# EAGLE design MotorShield (EAGLE 6.6.0)
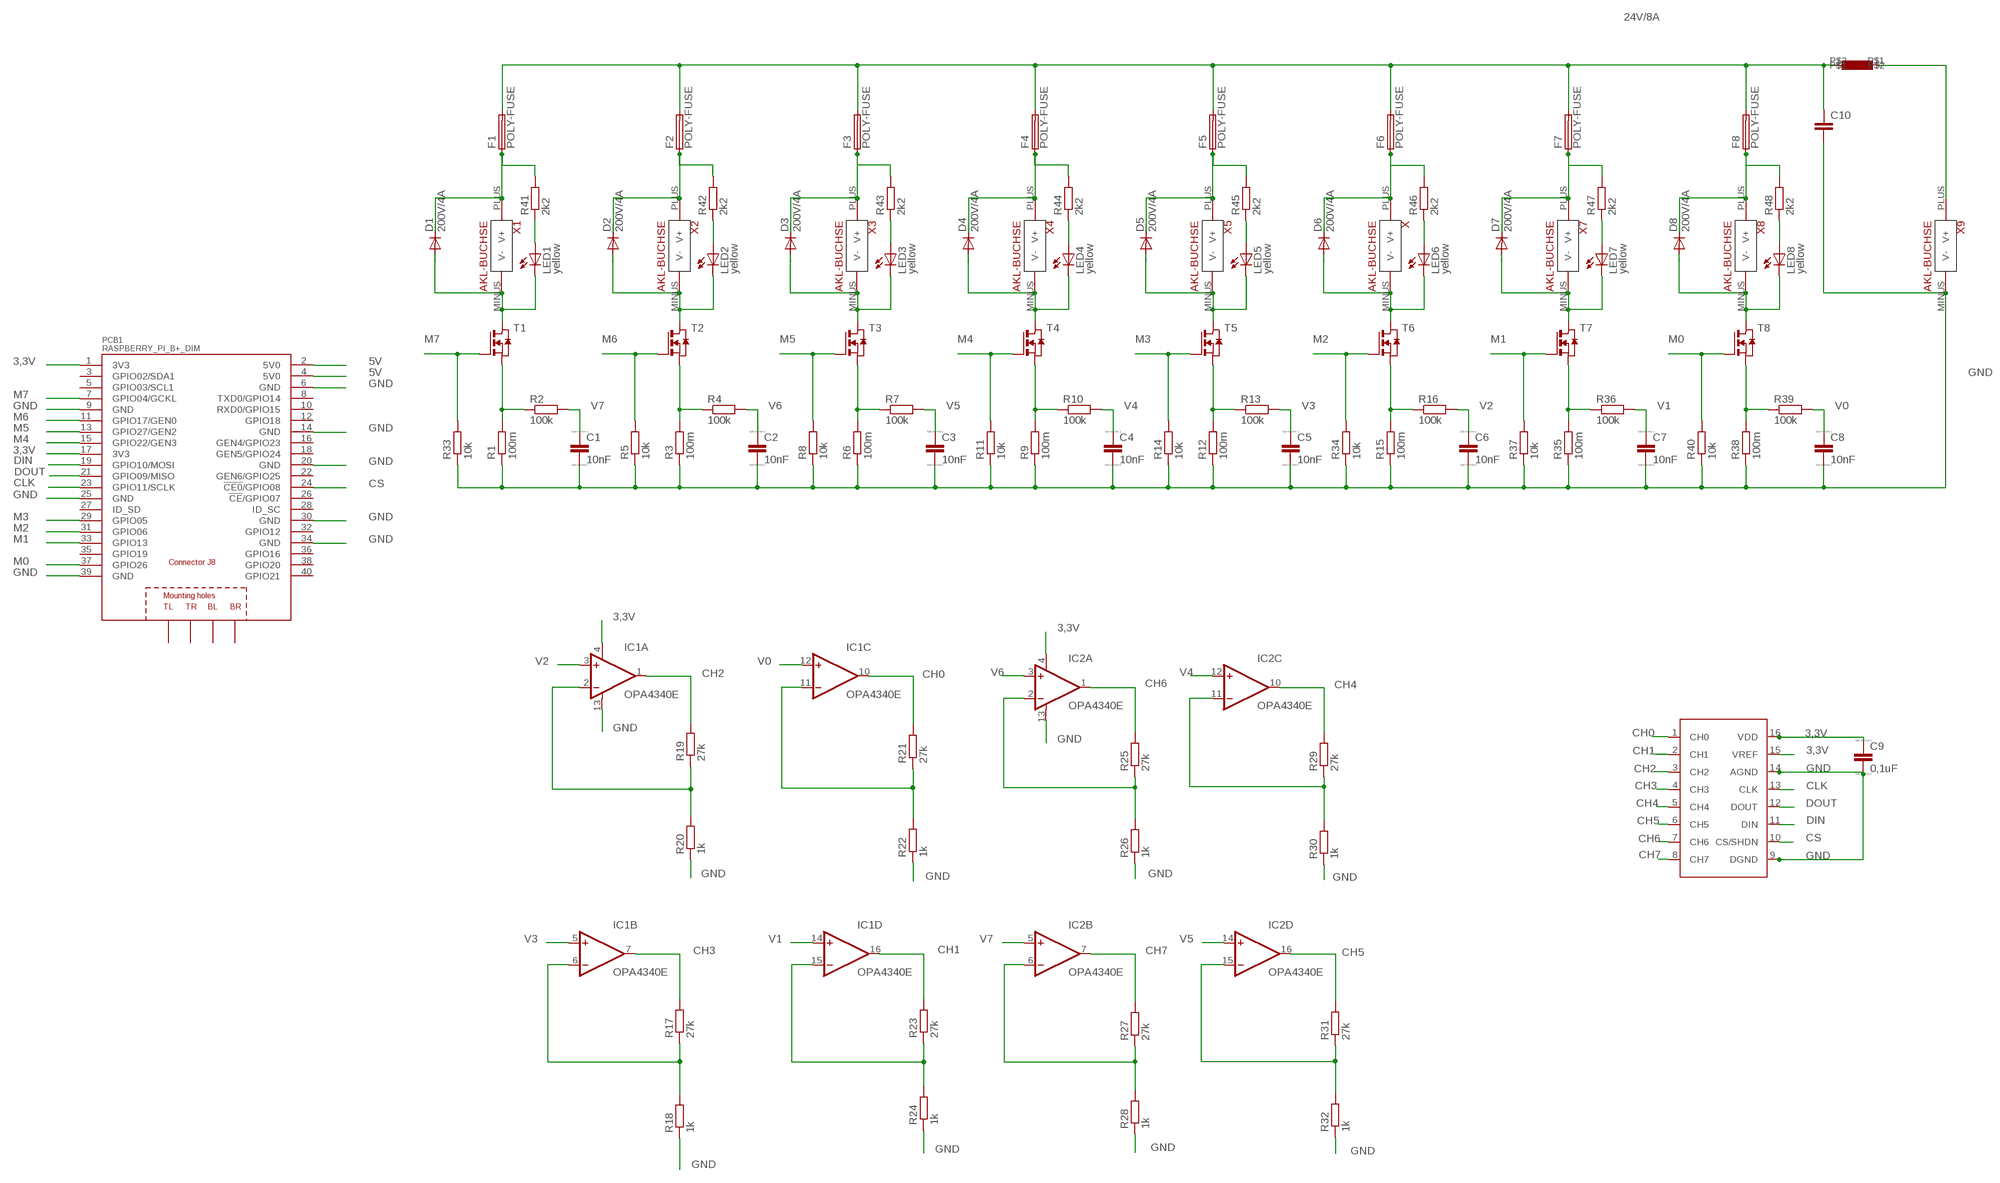
[diagram p0: schematic, sheet 1]

## Parts
C1  10nF  C  [C0805]
C2  10nF  C  [C0805]
C3  10nF  C  [C0805]
C4  10nF  C  [C0805]
C5  10nF  C  [C0805]
C6  10nF  C  [C0805]
C7  10nF  C  [C0805]
C8  10nF  C  [C0805]
C9  0,1uF  C  [C0805]
C10  C-EUC1812  [C1812]
D1  200V/4A  DIODE-DO214AA  [DO214AA]
D2  200V/4A  DIODE-DO214AA  [DO214AA]
D3  200V/4A  DIODE-DO214AA  [DO214AA]
D4  200V/4A  DIODE-DO214AA  [DO214AA]
D5  200V/4A  DIODE-DO214AA  [DO214AA]
D6  200V/4A  DIODE-DO214AA  [DO214AA]
D7  200V/4A  DIODE-DO214AA  [DO214AA]
D8  200V/4A  DIODE-DO214AA  [DO214AA]
F1  POLY-FUSE  [1812L050]
F2  POLY-FUSE  [1812L050]
F3  POLY-FUSE  [1812L050]
F4  POLY-FUSE  [1812L050]
F5  POLY-FUSE  [1812L050]
F6  POLY-FUSE  [1812L050]
F7  POLY-FUSE  [1812L050]
F8  POLY-FUSE  [1812L050]
IC1  OPA4340E  [SSOP16BU]
IC2  OPA4340E  [SSOP16BU]
IC3  MCP3008SO16  [SO16]
L1  MPI4040  [4040]
LED1  yellow  LEDCHIP-LED0603  [CHIP-LED0603]
LED2  yellow  LEDCHIP-LED0603  [CHIP-LED0603]
LED3  yellow  LEDCHIP-LED0603  [CHIP-LED0603]
LED4  yellow  LEDCHIP-LED0603  [CHIP-LED0603]
LED5  yellow  LEDCHIP-LED0603  [CHIP-LED0603]
LED6  yellow  LEDCHIP-LED0603  [CHIP-LED0603]
LED7  yellow  LEDCHIP-LED0603  [CHIP-LED0603]
LED8  yellow  LEDCHIP-LED0603  [CHIP-LED0603]
PCB1  RASPBERRY_PI_B+_DIM  [RASPBERRY_PI_BPLUS_DIM]
R1  100m  R-EU_R0805  [R0805]
R2  100k  R-EU_R0805  [R0805]
R3  100m  R-EU_R0805  [R0805]
R4  100k  R-EU_R0805  [R0805]
R5  10k  R-EU_R0805  [R0805]
R6  100m  R-EU_R0805  [R0805]
R7  100k  R-EU_R0805  [R0805]
R8  10k  R-EU_R0805  [R0805]
R9  100m  R-EU_R0805  [R0805]
R10  100k  R-EU_R0805  [R0805]
R11  10k  R-EU_R0805  [R0805]
R12  100m  R-EU_R0805  [R0805]
R13  100k  R-EU_R0805  [R0805]
R14  10k  R-EU_R0805  [R0805]
R15  100m  R-EU_R0805  [R0805]
R16  100k  R-EU_R0805  [R0805]
R17  27k  R-EU_R0805  [R0805]
R18  1k  R-EU_R0805  [R0805]
R19  27k  R-EU_R0805  [R0805]
R20  1k  R-EU_R0805  [R0805]
R21  27k  R-EU_R0805  [R0805]
R22  1k  R-EU_R0805  [R0805]
R23  27k  R-EU_R0805  [R0805]
R24  1k  R-EU_R0805  [R0805]
R25  27k  R-EU_R0805  [R0805]
R26  1k  R-EU_R0805  [R0805]
R27  27k  R-EU_R0805  [R0805]
R28  1k  R-EU_R0805  [R0805]
R29  27k  R-EU_R0805  [R0805]
R30  1k  R-EU_R0805  [R0805]
R31  27k  R-EU_R0805  [R0805]
R32  1k  R-EU_R0805  [R0805]
R33  10k  R-EU_R0805  [R0805]
R34  10k  R-EU_R0805  [R0805]
R35  100m  R-EU_R0805  [R0805]
R36  100k  R-EU_R0805  [R0805]
R37  10k  R-EU_R0805  [R0805]
R38  100m  R-EU_R0805  [R0805]
R39  100k  R-EU_R0805  [R0805]
R40  10k  R-EU_R0805  [R0805]
R41  2k2  R-EU_R0603  [R0603]
R42  2k2  R-EU_R0603  [R0603]
R43  2k2  R-EU_R0603  [R0603]
R44  2k2  R-EU_R0603  [R0603]
R45  2k2  R-EU_R0603  [R0603]
R46  2k2  R-EU_R0603  [R0603]
R47  2k2  R-EU_R0603  [R0603]
R48  2k2  R-EU_R0603  [R0603]
T1  NMOSSOT23  [SOT-23]
T2  NMOSSOT23  [SOT-23]
T3  NMOSSOT23  [SOT-23]
T4  NMOSSOT23  [SOT-23]
T5  NMOSSOT23  [SOT-23]
T6  NMOSSOT23  [SOT-23]
T7  NMOSSOT23  [SOT-23]
T8  NMOSSOT23  [SOT-23]
X  AKL-BUCHSE  [AKL-BUCHSE]
X1  AKL-BUCHSE  [AKL-BUCHSE]
X2  AKL-BUCHSE  [AKL-BUCHSE]
X3  AKL-BUCHSE  [AKL-BUCHSE]
X4  AKL-BUCHSE  [AKL-BUCHSE]
X5  AKL-BUCHSE  [AKL-BUCHSE]
X7  AKL-BUCHSE  [AKL-BUCHSE]
X8  AKL-BUCHSE  [AKL-BUCHSE]
X9  AKL-BUCHSE  [AKL-BUCHSE]

## Nets
3,3V: C9.1 IC1.4(A:V+) IC2.4(A:V+) IC3.15(VREF) IC3.16(VDD) PCB1.1(3V3) PCB1.17(3V3)
5V: PCB1.2(5V0) PCB1.4(5V0)
24V/1A [2.2A]: D1.C F1.P$1 R41.2 X1.PLUS(V+)
24V/8A: C10.1 F1.P$2 F2.P$2 F3.P$2 F4.P$2 F5.P$2 F6.P$2 F7.P$2 F8.P$2 L1.P$2
CH0: IC1.10(C:OUT) IC3.1(CH0) R21.2
CH1: IC1.16(D:OUT) IC3.2(CH1) R23.2
CH2: IC1.1(A:OUT) IC3.3(CH2) R19.2
CH3: IC1.7(B:OUT) IC3.4(CH3) R17.2
CH4: IC2.10(C:OUT) IC3.5(CH4) R29.2
CH5: IC2.16(D:OUT) IC3.6(CH5) R31.2
CH6: IC2.1(A:OUT) IC3.7(CH6) R25.2
CH7: IC2.7(B:OUT) IC3.8(CH7) R27.2
CLK: IC3.13(CLK) PCB1.23(GPIO11/SCLK)
CS: IC3.10(CS/SHDN) PCB1.24(!CE0!/GPIO08)
DIN: IC3.11(DIN) PCB1.19(GPIO10/MOSI)
DOUT: IC3.12(DOUT) PCB1.21(GPIO09/MISO)
GND: C1.2 C2.2 C3.2 C4.2 C5.2 C6.2 C7.2 C8.2 C9.2 C10.2 IC1.13(A:V-) IC2.13(A:V-) IC3.9(DGND) IC3.14(AGND) PCB1.6(GND) PCB1.9(GND) PCB1.14(GND) PCB1.20(GND) PCB1.25(GND) PCB1.30(GND) PCB1.34(GND) PCB1.39(GND) R1.1 R3.1 R5.1 R6.1 R8.1 R9.1 R11.1 R12.1 R14.1 R15.1 R18.1 R20.1 R22.1 R24.1 R26.1 R28.1 R30.1 R32.1 R33.1 R34.1 R35.1 R37.1 R38.1 R40.1 X9.MINUS(V-)
M0: PCB1.37(GPIO26) R40.2 T8.3(G)
M1: PCB1.33(GPIO13) R37.2 T7.3(G)
M2: PCB1.31(GPIO06) R34.2 T6.3(G)
M3 [2.2A]: PCB1.29(GPIO05) R14.2 T5.3(G)
M4: PCB1.15(GPIO22/GEN3) R11.2 T4.3(G)
M5: PCB1.13(GPIO27/GEN2) R8.2 T3.3(G)
M6: PCB1.11(GPIO17/GEN0) R5.2 T2.3(G)
M7: PCB1.7(GPIO04/GCKL) R33.2 T1.3(G)
N$2 [2.2A]: D1.A LED1.C T1.1(D) X1.MINUS(V-)
N$3 [2.2A]: R1.2 R2.1 T1.2(S)
N$4 [2.2A]: D8.C F8.P$1 R48.2 X8.PLUS(V+)
N$5 [2.2A]: D7.C F7.P$1 R47.2 X7.PLUS(V+)
N$6: IC1.2(A:-IN) R19.1 R20.2
N$7 [2.2A]: D6.C F6.P$1 R46.2 X.PLUS(V+)
N$8 [2.2A]: D5.C F5.P$1 R45.2 X5.PLUS(V+)
N$9 [2.2A]: D4.C F4.P$1 R44.2 X4.PLUS(V+)
N$10 [2.2A]: D2.A LED2.C T2.1(D) X2.MINUS(V-)
N$11: R3.2 R4.1 T2.2(S)
N$12 [2.2A]: D3.C F3.P$1 R43.2 X3.PLUS(V+)
N$13 [2.2A]: D2.C F2.P$1 R42.2 X2.PLUS(V+)
N$15: IC1.6(B:-IN) R17.1 R18.2
N$16: LED1.A R41.1
N$17 [2.2A]: D3.A LED3.C T3.1(D) X3.MINUS(V-)
N$18: R6.2 R7.1 T3.2(S)
N$19: LED2.A R42.1
N$20: LED3.A R43.1
N$21: LED5.A R45.1
N$22: IC1.11(C:-IN) R21.1 R22.2
N$23: LED4.A R44.1
N$24: LED6.A R46.1
N$25: LED7.A R47.1
N$26 [2.2A]: D4.A LED4.C T4.1(D) X4.MINUS(V-)
N$27: IC1.15(D:-IN) R23.1 R24.2
N$28: L1.P$1 X9.PLUS(V+)
N$29: R9.2 R10.1 T4.2(S)
N$30: LED8.A R48.1
N$31: IC2.2(A:-IN) R25.1 R26.2
N$34: IC2.6(B:-IN) R27.1 R28.2
N$37: IC2.11(C:-IN) R29.1 R30.2
N$38 [2.2A]: D5.A LED5.C T5.1(D) X5.MINUS(V-)
N$39 [2.2A]: R12.2 R13.1 T5.2(S)
N$40: IC2.15(D:-IN) R31.1 R32.2
N$45 [2.2A]: D6.A LED6.C T6.1(D) X.MINUS(V-)
N$46: R15.2 R16.1 T6.2(S)
N$51 [2.2A]: D7.A LED7.C T7.1(D) X7.MINUS(V-)
N$52: R35.2 R36.1 T7.2(S)
N$57 [2.2A]: D8.A LED8.C T8.1(D) X8.MINUS(V-)
N$58: R38.2 R39.1 T8.2(S)
V0: C8.1 IC1.12(C:+IN) R39.2
V1: C7.1 IC1.14(D:+IN) R36.2
V2: C6.1 IC1.3(A:+IN) R16.2
V3: C5.1 IC1.5(B:+IN) R13.2
V4: C4.1 IC2.12(C:+IN) R10.2
V5: C3.1 IC2.14(D:+IN) R7.2
V6: C2.1 IC2.3(A:+IN) R4.2
V7: C1.1 IC2.5(B:+IN) R2.2
Unconnected: PCB1.3(GPIO02/SDA1) PCB1.5(GPIO03/SCL1) PCB1.8(TXD0/GPIO14) PCB1.10(RXD0/GPIO15) PCB1.12(GPIO18) PCB1.16(GEN4/GPIO23) PCB1.18(GEN5/GPIO24) PCB1.22(GEN6/GPIO25) PCB1.26(!CE!/GPIO07) PCB1.27(ID_SD) PCB1.28(ID_SC) PCB1.32(GPIO12) PCB1.35(GPIO19) PCB1.36(GPIO16) PCB1.38(GPIO20) PCB1.40(GPIO21) PCB1.PE_BL(BL) PCB1.PE_BR(BR) PCB1.PE_TL(TL) PCB1.PE_TR(TR)

## Library data of the parts
C1-C9 = eagle-ltspice:C: CAPACITOR, European symbol; SPICEMODEL: NONE; SPICEPREFIX: C
C10 = rcl:C-EU: CAPACITOR, European symbol
D1-D8 = diode:DIODE-: DIODE
F1-F8 = SMD-Fuse:POLY-FUSE
IC1 IC2 = burr-brown:OPA4340: Operational Amplifiers Source: http://focus.ti.com/lit/ds/sbos073/sbos073.pdf; MPN: OPA4340EA/250G4; OC_FARNELL: 1207061; OC_NEWARK: 67K8209
IC3 = MSC3008:MCP3008
L1 = Spule:MPI4040
LED1-LED8 = led:LED: LED OSRAM: - CHIPLED LG R971, LG N971, LY N971, LG Q971, LY Q971, LO R971, LY R971 LH N974, LH R974 LS Q976, LO Q976, LY Q976 LO Q996 - Hyper CHIPLED LW Q18S LB Q993, LB Q99A, LB R99A - SideLED LS A670, LO A670, LY A670, LG A670, LP A670 LB A673, LV A673, LT A673, LW A673 LH A674 LY A675 LS A676, LA A676, LO A676, LY A676, LW A676 LS A679, LY A679, LG A679 - Hyper Micro SIDELED® LS Y876, LA Y876, LO Y876, LY Y876 LT Y87S - SmartLED LW L88C, LW L88S LB L89C, LB L89S, LG L890 LS L89K, LO L89K, LY L89K LS L896, LA L896, LO L896, LY L896 - TOPLED LS T670, LO T670, LY T670, LG T670, LP T670 LSG T670, LSP T670, LSY T670, LOP T670, LYG T670 LG T671, LOG T671, LSG T671 LB T673, LV T673, LT T673, LW T673 LH T674 LS T676, LA T676, LO T676, LY T676, LB T676, LH T676, LSB T676, LW T676 LB T67C, LV T67C, LT T67C, LS T67K, LO T67K, LY T67K, LW E67C LS E67B, LA E67B, LO E67B, LY E67B, LB E67C, LV E67C, LT E67C LW T67C LS T679, LY T679, LG T679 LS T770, LO T770, LY T770, LG T770, LP T770 LB T773, LV T773, LT T773, LW T773 LH T774 LS E675, LA E675, LY E675, LS T675 LS T776, LA T776, LO T776, LY T776, LB T776 LHGB T686 LT T68C, LB T68C - Hyper Mini TOPLED® LB M676 - Mini TOPLED Santana® LG M470 LS M47K, LO M47K, LY M47K Source: http://www.osram.convergy.de LUXEON: - LUMILED® LXK2-PW12-R00, LXK2-PW12-S00, LXK2-PW14-U00, LXK2-PW14-V00 LXK2-PM12-R00, LXK2-PM12-S00, LXK2-PM14-U00 LXK2-PE12-Q00, LXK2-PE12-R00, LXK2-PE12-S00, LXK2-PE14-T00, LXK2-PE14-U00 LXK2-PB12-K00, LXK2-PB12-L00, LXK2-PB12-M00, LXK2-PB14-N00, LXK2-PB14-P00, LXK2-PB14-Q00 LXK2-PR12-L00, LXK2-PR12-M00, LXK2-PR14-Q00, LXK2-PR14-R00 LXK2-PD12-Q00, LXK2-PD12-R00, LXK2-PD12-S00 LXK2-PH12-R00, LXK2-PH12-S00 LXK2-PL12-P00, LXK2-PL12-Q00, LXK2-PL12-R00 Source: www.luxeon.com KINGBRIGHT: KA-3528ASYC Source: www.kingbright.com
PCB1 = RASPBERRY_PI_GPIO:RASPBERRY_PI_B+: Raspberry Pi B+ Basedon issue: Thursday, July 10, 2014 - Rev 1.2 LBR by Tim Rettmann 07-2014
R1-R48 = rcl:R-EU_: RESISTOR, European symbol
T1-T8 = zetex:NMOSSOT23: MOS FET; OC_FARNELL: unknown; OC_NEWARK: unknown
X X1-X5 X7-X9 = Anschluss:AKL-BUCHSE

## Net classes
0 default: width 0.025 mm, clearance 0.025 mm
1 2.2A: width 0.076 mm, clearance 0.076 mm to class 0, clearance 0.076 mm

## Board
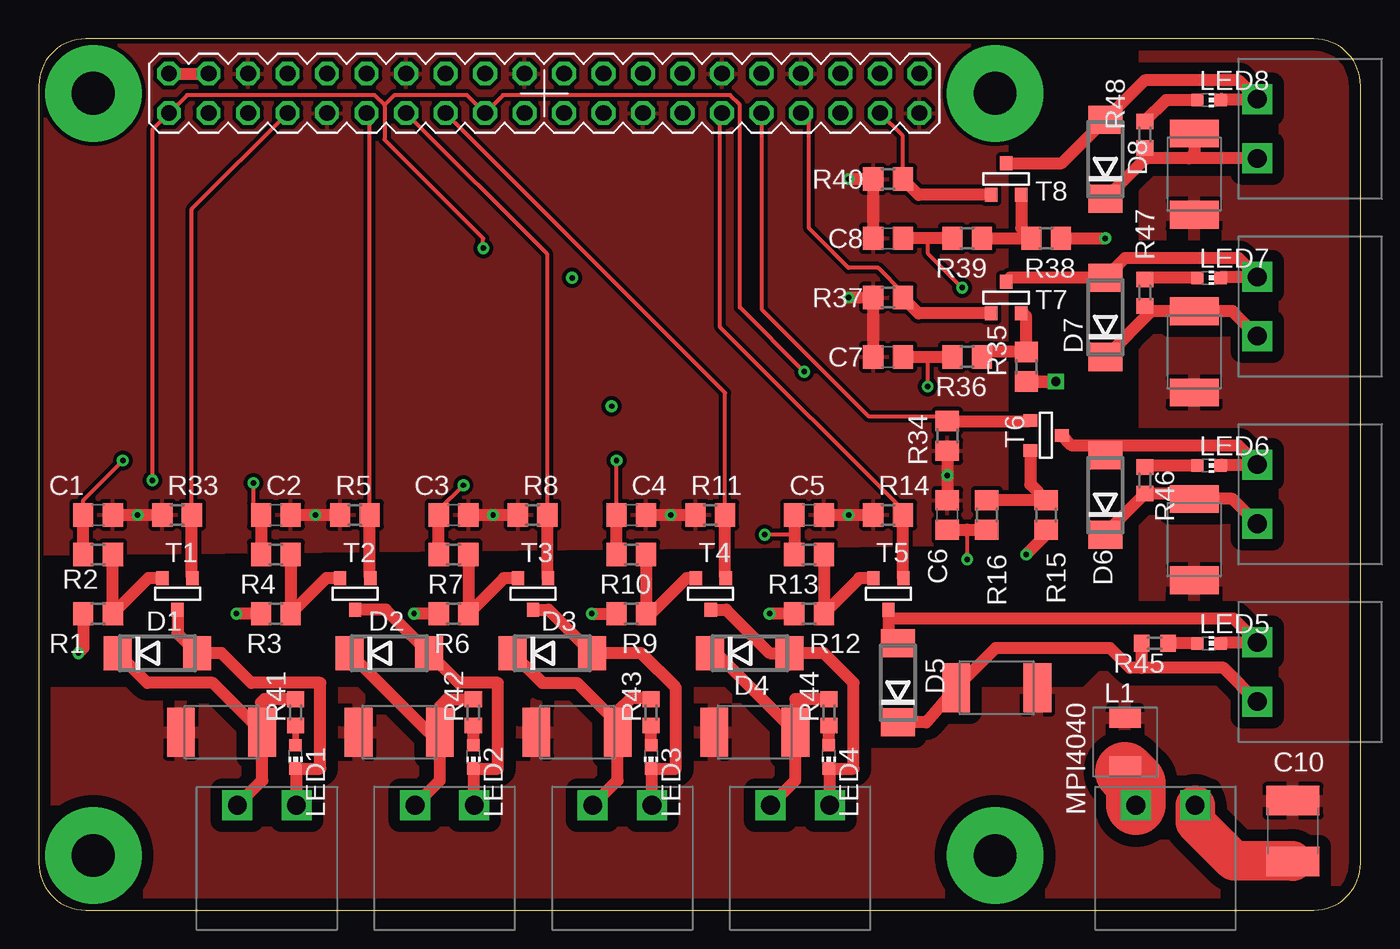
[diagram p1: board, top side]
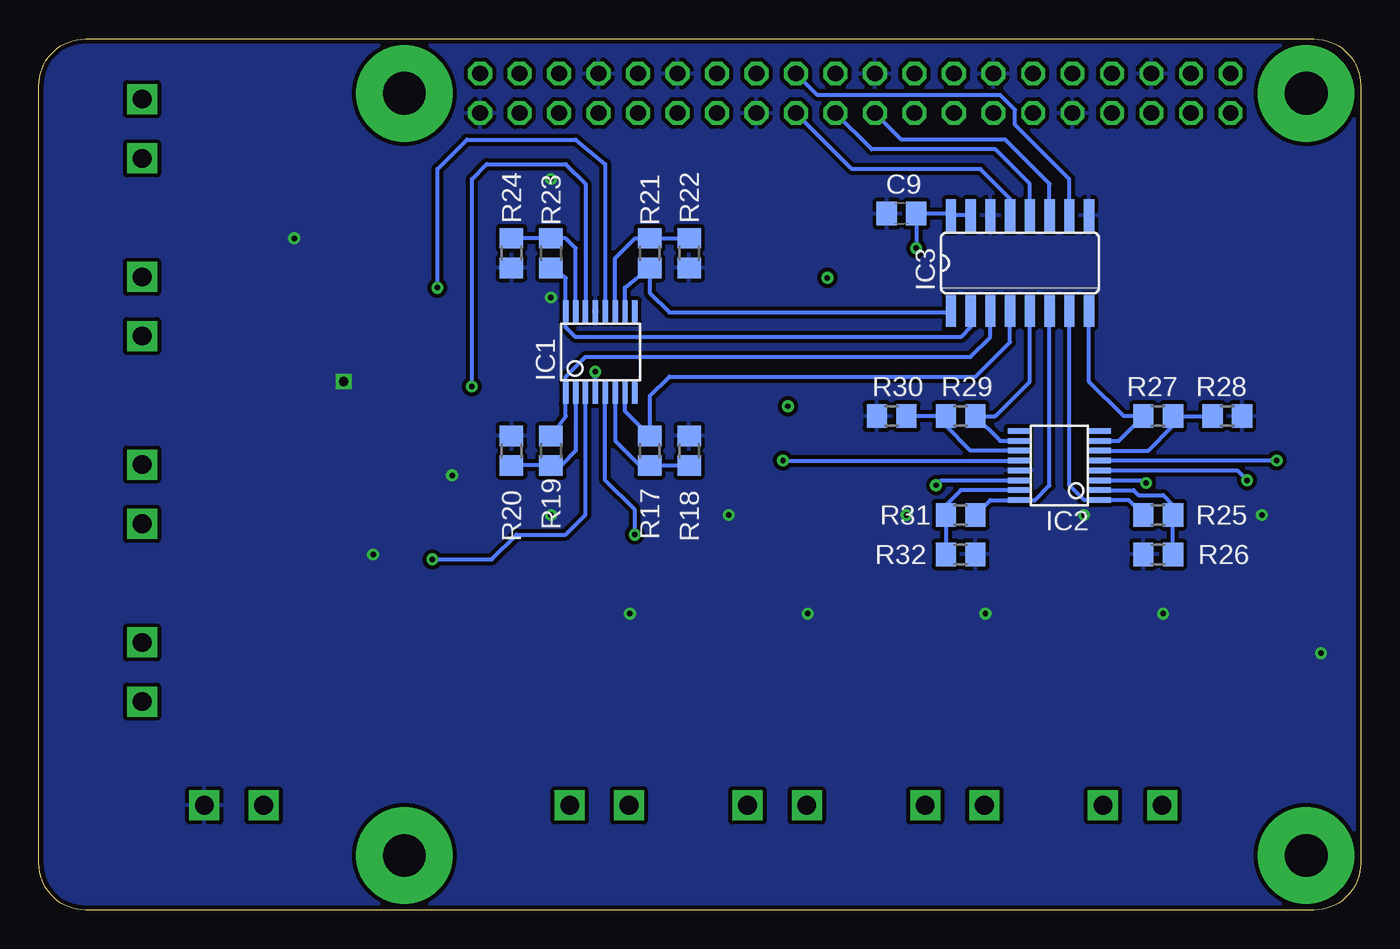
[diagram p2: board, bottom side, seen from below]

Size 85 x 56 mm. Coordinates in mm from the lower left corner, seen from the top.
Copper layers (1*16): Top 0.035mm / dielectric 1.5mm / Bottom 0.035mm
Design rules "default *": minimum track width 6mil, minimum drill 12mil, track to track 6mil, track to pad 6mil, pad to pad 6mil, via to via 6mil, smd to smd 6mil, copper to edge 12mil, drill to drill 6mil, minimum pad ring 10mil, minimum via ring 8mil, stop-mask expansion 4mil, vias tented up to drill 0mil, thermal gap 10mil

### Footprints (pad centres in the part's own frame; a part is rotated, then mirrored left to right if it is on the bottom)
C0805 = smd 1.3 x 1.5: 1 -0.95,0; 2 0.95,0
C1812 = smd 1.9 x 3.4: 1 -1.95,0; 2 1.95,0
DO214AA = smd 1.8 x 2.2: A 2.55,0; C -2.55,0
1812L050 = smd 1.78 x 3.15: P$1 -2.615,0; P$2 2.615,0
SSOP16BU = smd 0.348 x 1.397: 1 -2.223,-2.619; 2 -1.588,-2.62; 3 -0.953,-2.62; 4 -0.318,-2.62; 5 0.318,-2.62; 6 0.953,-2.62; 7 1.588,-2.62; 8 2.223,-2.62; 9 2.223,2.62; 10 1.588,2.62; 11 0.953,2.62; 12 0.318,2.62; 13 -0.318,2.62; 14 -0.953,2.62; 15 -1.588,2.62; 16 -2.223,2.62
SO16 = smd 0.66 x 2.032: 1 -4.445,-3.073; 2 -3.175,-3.073; 3 -1.905,-3.073; 4 -0.635,-3.073; 5 0.635,-3.073; 6 1.905,-3.073; 7 3.175,-3.073; 8 4.445,-3.073; 9 4.445,3.073; 10 3.175,3.073; 11 1.905,3.073; 12 0.635,3.073; 13 -0.635,3.073; 14 -1.905,3.073; 15 -3.175,3.073; 16 -4.445,3.073
4040 = smd 2 x 1.3: P$1 0,1.575; P$2 0,-1.575
CHIP-LED0603 = smd 0.8 x 0.8: A 0,-0.75; C 0,0.75
RASPBERRY_PI_BPLUS_DIM = drill 1.016 octagon: 1 8.37,51.23; 2 8.37,53.77; 3 10.91,51.23; 4 10.91,53.77; 5 13.45,51.23; 6 13.45,53.77; 7 15.99,51.23; 8 15.99,53.77; 9 18.53,51.23; 10 18.53,53.77; 11 21.07,51.23; 12 21.07,53.77; 13 23.61,51.23; 14 23.61,53.77; 15 26.15,51.23; 16 26.15,53.77; 17 28.69,51.23; 18 28.69,53.77; 19 31.23,51.23; 20 31.23,53.77; 21 33.77,51.23; 22 33.77,53.77; 23 36.31,51.23; 24 36.31,53.77; 25 38.85,51.23; 26 38.85,53.77; 27 41.39,51.23; 28 41.39,53.77; 29 43.93,51.23; 30 43.93,53.77; 31 46.47,51.23; 32 46.47,53.77; 33 49.01,51.23; 34 49.01,53.77; 35 51.55,51.23; 36 51.55,53.77; 37 54.09,51.23; 38 54.09,53.77; 39 56.63,51.23; 40 56.63,53.77 | drill 2.75 pad 6.2: PE_BL 3.5,3.5; PE_BR 61.5,3.5; PE_TL 3.5,52.5; PE_TR 61.5,52.5
R0805 = smd 1.3 x 1.5: 1 -0.95,0; 2 0.95,0
R0603 = smd 1 x 1.1: 1 -0.85,0; 2 0.85,0
SOT-23 = smd 0.787 x 0.889: 1 0.025,-1.016; 2 -0.94,1.016; 3 0.991,1.016
AKL-BUCHSE = drill 1.2 pad 1.93 square: MINUS 6.41,8; PLUS 2.6,8

### Placement (x,y rotation side)
C1  3.81,25.4 0 top
C2  15.24,25.4 0 top
C3  26.67,25.4 0 top
C4  38.1,25.4 0 top
C5  49.53,25.4 0 top
C6  58.42,25.4 90 top
C7  54.61,35.56 180 top
C8  54.61,43.18 180 top
C9  29.53,44.77 180 bottom
C10  80.64,5.08 270 top
D1  7.62,16.51 0 top
D2  22.54,16.51 0 top
D3  33.02,16.51 0 top
D4  45.72,16.51 0 top
D5  55.24,14.61 90 top
D6  68.58,26.67 90 top
D7  68.58,38.1 90 top
D8  68.58,48.26 90 top
F1  11.75,11.43 180 top
F2  23.18,11.43 180 top
F3  34.61,11.43 180 top
F4  46.04,11.43 180 top
F5  61.59,14.29 0 top
F6  74.3,23.81 270 top
F7  74.3,35.88 270 top
F8  74.3,47.31 270 top
IC1  48.9,35.88 0 bottom
IC2  19.37,28.57 90 bottom
IC3  21.91,41.59 0 bottom
L1  69.85,10.79 180 top
LED1  16.51,9.84 180 top
LED2  27.94,9.84 180 top
LED3  39.37,9.84 180 top
LED4  50.8,9.84 180 top
LED5  75.25,17.14 270 top
LED6  75.25,28.57 270 top
LED7  75.25,40.64 270 top
LED8  75.25,52.07 270 top
PCB1  0,0 0 top
R1  3.81,19.05 0 top
R2  3.81,22.86 180 top
R3  15.24,19.05 0 top
R4  15.24,22.86 180 top
R5  20.32,25.4 0 top
R6  26.67,19.05 0 top
R7  26.67,22.86 180 top
R8  31.75,25.4 0 top
R9  38.1,19.05 0 top
R10  38.1,22.86 180 top
R11  43.18,25.4 0 top
R12  49.53,19.05 0 top
R13  49.53,22.86 180 top
R14  54.61,25.4 0 top
R15  64.77,25.4 90 top
R16  60.96,25.4 270 top
R17  45.72,29.53 90 bottom
R18  43.18,29.53 270 bottom
R19  52.07,29.53 90 bottom
R20  54.61,29.53 270 bottom
R21  45.72,42.23 270 bottom
R22  43.18,42.23 90 bottom
R23  52.07,42.23 270 bottom
R24  54.61,42.23 90 bottom
R25  13.02,25.4 180 bottom
R26  13.02,22.86 0 bottom
R27  13.02,31.75 180 bottom
R28  8.57,31.75 180 bottom
R29  25.72,31.75 0 bottom
R30  30.16,31.75 0 bottom
R31  25.72,25.4 0 bottom
R32  25.72,22.86 180 bottom
R33  8.89,25.4 0 top
R34  58.42,30.48 90 top
R35  63.5,34.92 90 top
R36  59.69,35.56 180 top
R37  54.61,39.37 0 top
R38  64.77,43.18 180 top
R39  59.69,43.18 180 top
R40  54.61,46.99 0 top
R41  16.51,12.7 90 top
R42  27.94,12.7 90 top
R43  39.37,12.7 90 top
R44  50.8,12.7 90 top
R45  71.75,17.14 180 top
R46  71.12,27.62 270 top
R47  71.12,39.69 270 top
R48  71.12,49.85 270 top
T1  8.89,20.32 0 top
T2  20.32,20.32 0 top
T3  31.75,20.32 0 top
T4  43.18,20.32 0 top
T5  54.61,20.32 0 top
T6  64.77,30.48 90 top
T7  62.23,39.37 180 top
T8  62.23,46.99 180 top
X  86.36,22.23 90 top
X1  10.16,-1.27 0 top
X2  21.59,-1.27 0 top
X3  33.02,-1.27 0 top
X4  44.45,-1.27 0 top
X5  86.36,10.79 90 top
X7  86.36,34.29 90 top
X8  86.36,45.72 90 top
X9  67.94,-1.27 0 top

### Tracks (layer width: path | path; a pad name or v marks a point on that pad's centre or on a via)
3,3V  (via drill 0.35)
  Top 0.254: v28.57,42.55 28.57,43.18 22.23,49.53 22.23,51.75 | 22.23,51.75 21.59,52.39 9.53,52.39 PCB1.1 7.3,50.16 v7.3,27.62 | v49.21,34.61 45.09,38.73 45.09,51.75 44.45,52.39 29.84,52.39 PCB1.17 27.53,52.39 22.86,52.39 22.23,51.75
  Bottom 0.254: IC3.15 IC3.16 26.45,44.77 C9.1 v28.58,42.55 v28.57,42.55 | IC1.4 v49.21,34.61 | IC2.4 7.94,28.26 v7.3,27.62
5V
  Top 0.762: PCB1.2 PCB1.4
24V/1A
  Top 0.762: X1.PLUS 14.36,8.33 F1.P$1 14.01,11.79 | 14.01,11.79 11.19,14.61 6.97,14.61 D1.C | R41.2 14.5,13.55 14.29,13.34 14.29,12.06 14.01,11.79
24V/8A
  pour Top (isolate 0.762): 0,13.97 67.31,13.97 71.12,17.78 71.12,55.88 85.09,55.88 85.09,0 0,0
CH0
  Bottom 0.254: IC1.10 47.31,40.01 R21.2 45.72,39.69 44.45,38.42 26.45,38.42 IC3.1
CH1
  Bottom 0.254: R23.2 51.12,40.64 IC1.16 51.12,38.81 51.12,37.47 50.48,36.83 25.72,36.83 25.08,37.47 IC3.2
CH2
  Bottom 0.254: R19.2 51.12,31.75 IC1.1 51.12,34.29 49.85,35.56 25.08,35.56 23.81,36.83 IC3.3
CH3
  Bottom 0.254: IC3.4 22.54,36.51 24.77,34.29 44.45,34.29 45.72,33.02 R17.2 47.31,32.06 IC1.7
CH4
  Bottom 0.254: IC2.10 23.18,30.16 R29.2 23.5,31.75 21.27,33.97 IC3.5
CH5
  Bottom 0.254: R31.2 23.82,26.35 IC2.16 20.96,26.35 20,27.3 IC3.6
CH6
  Bottom 0.254: R25.2 14.92,26.35 IC2.1 17.78,26.35 18.73,27.3 IC3.7
CH7
  Bottom 0.254: IC2.7 15.55,30.16 R27.2 15.24,31.75 17.46,33.97 IC3.8
CLK
  Bottom 0.254: IC3.13 22.54,45.72 24.45,47.62 32.7,47.62 PCB1.23
CS
  Bottom 0.254: IC3.10 18.73,46.99 22.23,50.48 22.23,51.44 23.18,52.39 34.93,52.39 PCB1.24
DIN
  Bottom 0.254: IC3.11 20,46.67 22.86,49.53 29.53,49.53 PCB1.19
DOUT
  Bottom 0.254: IC3.12 21.27,46.67 23.5,48.9 31.43,48.9 PCB1.21
GND  (via drill 0.35, 0.6)
  Top 0.762: v35.56,19.05 R9.1 | R1.1 2.86,16.83 v2.54,16.51 | C1.2 v6.35,25.4 R33.1 | C2.2 v17.78,25.4 R5.1 | C3.2 v29.21,25.4 R8.1 | C4.2 v40.64,25.4 R11.1 | C5.2 v52.07,25.4 R14.1 | R3.1 v12.7,19.05 | R6.1 v24.13,19.05 | R12.1 v46.99,19.05 | R34.1 v58.42,27.94 C6.2 | R15.1 64.77,24.13 v63.5,22.86 | C8.2 R40.1 v52.07,46.99 | C7.2 R37.1 v52.07,39.37 | R38.1 v68.58,43.18
  Top 0.813: R35.1 v65.41,33.97
  Top 2.54: X9.MINUS 74.36,5.66 76.83,3.17 80.6,3.17 C10.2
  pour Bottom (isolate 0.254): -2.54,58.42 95.25,58.42 95.25,-3.81 -2.54,-3.81
  pour Top (isolate 0.254): 0,56.52 62.23,56.52 62.23,26.67 59.05,23.5 -0.64,22.86 -0.64,55.88
M0
  Top 0.254: R40.2 55.56,49.76 PCB1.37
  Top 0.762: T8.3 56.58,45.97 R40.2
M1
  Top 0.254: R37.2 55.56,39.69 53.98,41.27 52.07,41.27 49.53,43.81 49.53,50.71 PCB1.33
  Top 0.762: T7.3 56.58,38.35 R37.2
M2
  Top 0.254: PCB1.31 46.47,38.62 53.34,31.75 58.1,31.75 R34.2
  Top 0.762: R34.2 63.71,31.43 T6.3
M3
  Top 0.254: R14.2 55.56,25.72 43.81,37.47 43.81,51.12 PCB1.29
  Top 0.762: R14.2 55.56,21.38 T5.3
M4
  Top 0.254: R11.2 44.13,33.25 PCB1.15
  Top 0.762: R11.2 44.13,21.38 T4.3
M5
  Top 0.254: R8.2 32.7,42.14 PCB1.13
  Top 0.762: R8.2 32.7,21.38 T3.3
M6
  Top 0.254: R5.2 21.27,51.03 PCB1.11
  Top 0.762: R5.2 21.27,21.38 T2.3
M7
  Top 0.254: R33.2 9.84,45.08 PCB1.7
  Top 0.762: R33.2 9.84,21.38 T1.3
N$1  (via drill 0.35)
  other vias: 36.83,32.38
N$2
  Top 0.762: T1.1 8.91,17.77 D1.A 11.75,16.51 13.65,14.61 18.1,14.61 18.1,9.09 LED1.C 16.57,9.03 X1.MINUS
N$3
  Top 0.762: R2.1 R1.2 7.05,21.34 T1.2
N$4
  Top 0.762: X8.PLUS 73.98,48.32 | 73.98,48.32 71.19,48.32 71.12,48.26 | 71.12,48.26 D8.C | R48.2 71.12,48.26 | F8.P$1 74.3,48.64 73.98,48.32
N$5
  Top 0.762: 71.52,38.49 F7.P$1 76.76,38.49 X7.PLUS | 71.52,38.49 D7.C | R47.2 71.18,38.84 71.52,38.49
N$6
  Bottom 0.254: R20.2 R19.1 51.44,28.57 50.48,29.53 IC1.2
N$7
  Top 0.762: X.PLUS 76.76,26.43 F6.P$1 73.95,26.77 R46.2 68.58,24.23 D6.C
N$8
  Top 0.762: X5.PLUS 76.2,15.56 70.91,15.56 | D5.C 57.06,12.05 F5.P$1 61.52,16.83 68.9,16.83 70.17,15.56 70.91,15.56 | R45.2 70.91,15.56
N$9
  Top 0.762: F4.P$1 43.57,16.51 D4.C | R44.2 48.65,13.55 F4.P$1 | X4.PLUS 48.65,8.33 F4.P$1
N$10
  Top 0.762: X2.MINUS 28,9.09 LED2.C 29.53,9.09 29.53,14.61 27,14.61 D2.A 22.3,19.3 T2.1
N$11
  Top 0.762: T2.2 18.48,21.34 R3.2 R4.1
N$12
  Top 0.762: X3.PLUS 37.22,8.33 F3.P$1 | F3.P$1 37.22,12.78 38.1,13.65 39.27,13.65 R43.2 | D3.C 32.38,14.61 34.61,14.61 37.22,11.99 F3.P$1
N$13
  Top 0.762: X2.PLUS 25.79,8.33 F2.P$1 | F2.P$1 25.07,11.43 D2.C | F2.P$1 25.79,13.09 26.25,13.55 R42.2
N$14  (via drill 0.35)
  other vias: 34.29,40.64
N$15
  Bottom 0.254: R18.2 R17.1 46.35,28.57 47.94,30.16 IC1.6
N$16
  Top 0.406: LED1.A R41.1
N$17
  Top 0.762: T3.1 32.78,19.3 D3.A 38.73,16.51 40.96,14.29 40.96,9.09 LED3.C 39.43,9.03 X3.MINUS
N$18
  Top 0.762: T3.2 29.91,21.34 R6.2 R7.1
N$19
  Top 0.762: LED2.A R42.1
N$20
  Top 0.762: LED3.A R43.1
N$21
  Top 0.762: LED5.A R45.1
N$22
  Bottom 0.254: R22.2 R21.1 46.67,43.18 47.94,41.91 IC1.11
N$23
  Top 0.762: LED4.A R44.1
N$24
  Top 0.762: LED6.A 71.22,28.57 arc90 R46.1
N$25
  Top 0.762: LED7.A 71.22,40.64 arc90 R47.1
N$26
  Top 0.762: T4.1 44.2,19.3 46.99,16.51 D4.A 50.48,16.51 52.39,14.61 52.39,9.09 LED4.C 50.86,9.09 X4.MINUS
N$27
  Bottom 0.254: R24.2 R23.1 51.12,43.18 50.48,42.55 IC1.15
N$28
  Top 1.27: 69.85,8.89 L1.P$1
  Top 3.81: X9.PLUS 70.55,8.2 69.85,8.89
N$29
  Top 0.762: T4.2 41.66,21.34 39.37,19.05 R9.2 R10.1
N$30
  Top 0.762: LED8.A 72.49,52.07 R48.1
N$31
  Bottom 0.254: R26.2 R25.1 12.07,26.03 12.06,26.04 12.7,26.67 14.29,26.67 14.61,26.99 IC2.2
N$34
  Bottom 0.254: R28.2 R27.1 12.06,31.11 13.65,29.53 IC2.6
N$37
  Bottom 0.254: R30.2 R29.1 26.67,31.11 25.08,29.53 IC2.11
N$38
  Top 0.762: T5.1 54.63,18.73 | 54.63,18.73 54.63,17.82 D5.A | 54.63,18.73 76.83,18.73 X5.MINUS 76.06,17.2 LED5.C
N$39
  Top 0.762: T5.2 52.77,21.34 R12.2 R13.1
N$40
  Bottom 0.254: R32.2 R31.1 26.67,26.04 25.72,26.99 IC2.15
N$45
  Top 0.762: 68.58,29.84 77.15,29.84 X.MINUS 76.06,28.64 LED6.C | 68.58,29.84 66.45,29.84 T6.1 | D6.A 68.58,29.84
N$46
  Top 0.762: T6.2 63.75,27.37 R15.2 R16.1
N$51
  Top 0.762: T7.1 62.47,40.65 D7.A 69.84,41.91 77.15,41.91 X7.MINUS 76.06,40.7 LED7.C
N$52
  Top 0.762: T7.2 arc-90 63.5,38.02 R35.2 60.95,35.88 arc90 R36.1
  Top 0.813: R36.1 60.64,35.88
N$57
  Top 0.762: T8.1 65.78,48.01 D8.A 71.11,53.34 77.15,53.34 X8.MINUS 76.06,52.13 LED8.C
N$58
  Top 0.762: T8.2 63.17,43.83 R38.2 R39.1
V0  (via drill 0.35)
  Top 0.254: 57.15,43.18 57.15,42.23 v59.37,40.01
  Top 0.762: R39.2 57.15,43.18 C8.1
  Bottom 0.254: v59.37,40.01 59.37,47.62 57.47,49.53 50.48,49.53 48.58,47.94 48.58,38.82 IC1.12
V1  (via drill 0.35)
  Top 0.254: 57.15,35.56 v57.15,33.66
  Top 0.762: C7.1 57.15,35.56 R36.2
  Bottom 0.254: v57.15,33.66 57.15,46.99 56.2,47.94 51.12,47.94 49.85,46.67 49.85,38.82 IC1.14
V2  (via drill 0.35)
  Top 0.254: 59.69,24.45 v59.69,22.54
  Top 0.762: C6.1 59.69,24.45 R16.2
  Bottom 0.254: v59.69,22.54 55.88,22.54 54.29,24.13 51.12,24.13 49.85,25.4 49.85,33.58 IC1.3
V3  (via drill 0.35)
  Top 0.254: 48.58,24.13 v46.67,24.13
  Top 0.762: C5.1 48.58,24.13 R13.2
  Bottom 0.254: v46.67,24.13 46.67,25.72 48.58,27.62 48.58,33.58 IC1.5
V4  (via drill 0.35)
  Top 0.254: C4.1 v37.15,28.89
  Top 0.762: R10.2 C4.1
  Bottom 0.254: v37.15,28.89 IC2.12
V5  (via drill 0.35)
  Top 0.254: C3.1 25.72,25.72 v27.3,27.3
  Top 0.762: R7.2 C3.1
  Bottom 0.254: v27.3,27.3 26.99,27.62 IC2.14 | IC2.14
V6  (via drill 0.35)
  Top 0.254: v13.79,27.46 13.79,25.9 C2.1
  Top 0.762: C2.1 R4.2
  Bottom 0.254: IC2.3 13.96,27.62 v13.79,27.46
V7  (via drill 0.35)
  Top 0.254: C1.1 2.86,26.35 v5.4,28.89
  Top 0.762: R2.2 C1.1
  Bottom 0.254: v5.4,28.89 IC2.5